# Altium project KB-PCB-R02.PrjPcb (part 1 of 2)
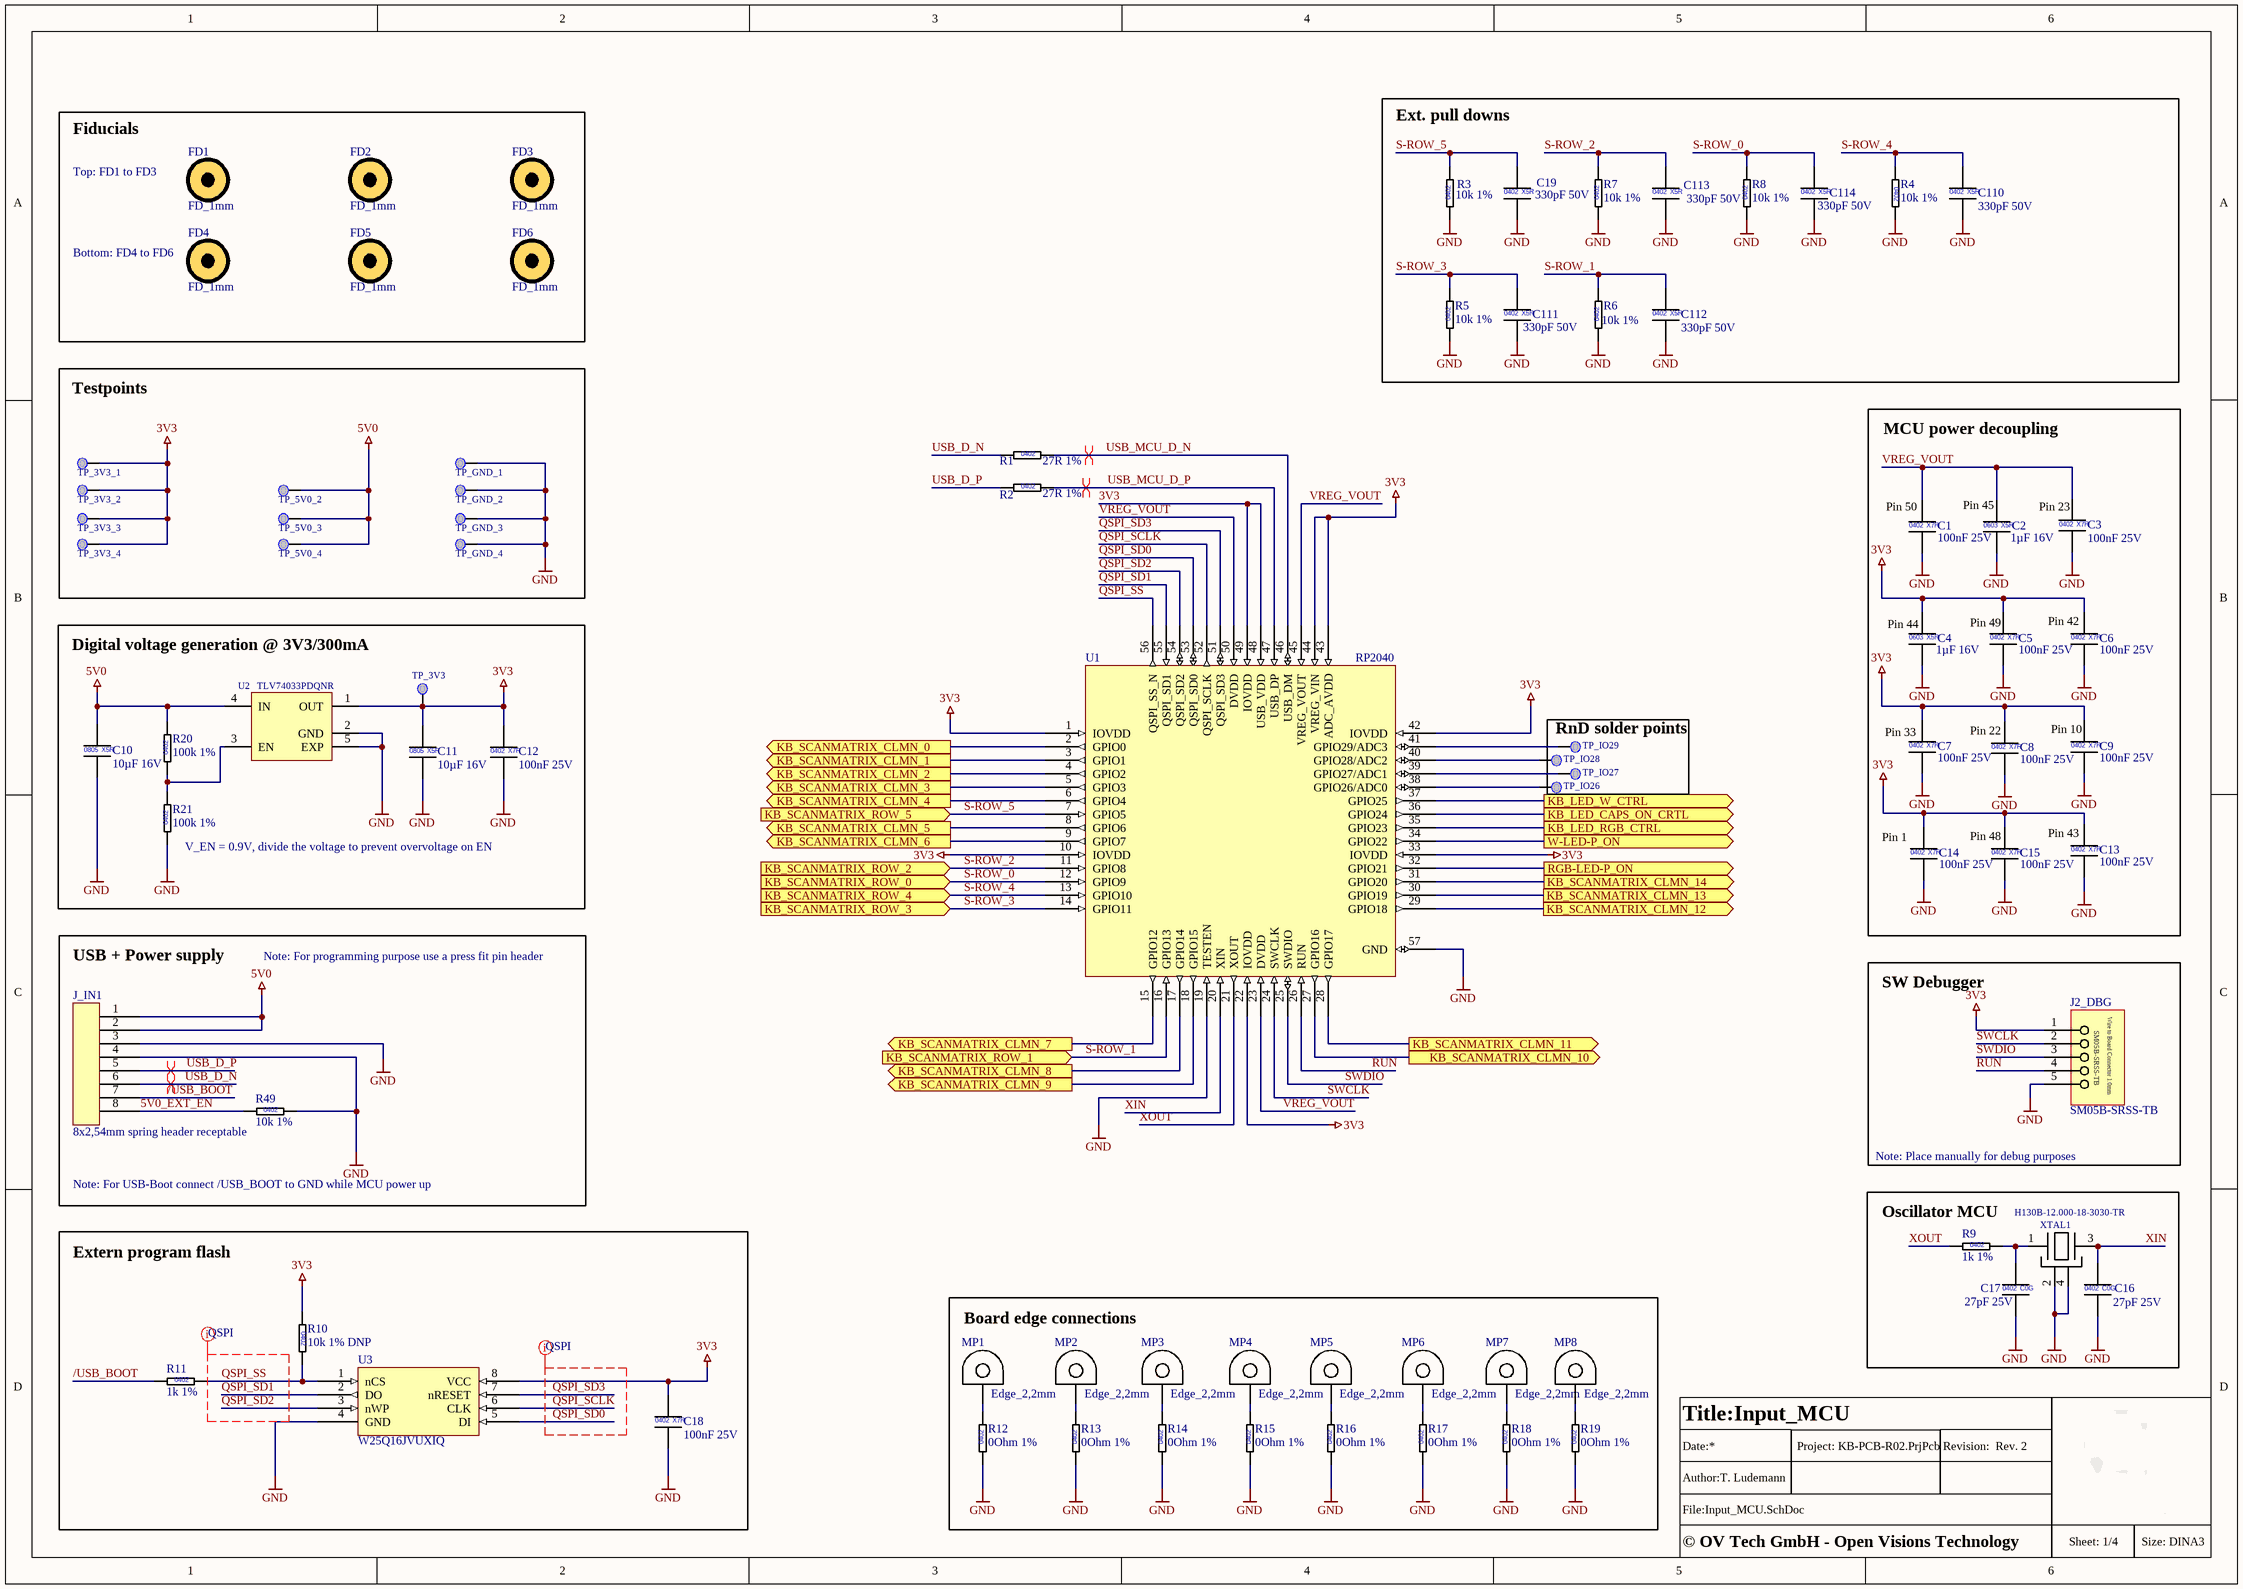
[diagram p0: Input_MCU.SchDoc]
Revision: Rev. 2
4 sheets, 690 parts. Net scope: flat (ports and power ports of the same name join across sheets).
Board file: KB-PCB-R02.PcbDoc
Sheets:
  Input_MCU.SchDoc
  Keymatrix_switches.SchDoc
  backlight_RGB.SchDoc
  backlight_W.SchDoc

## Sheet Input_MCU.SchDoc: Input_MCU
size 420 x 297 mm; Author: T. Ludemann; SheetNumber: 1; SheetTotal: 4; DocSize: DINA3

### Parts
(Parts that share a designator on the sheet are numbered #1, #2 ... from top to bottom, then left to right.)
?#1  (no value)  (graphical)
C1  100nF 25V  [CAPC1005X06L]
C2  1µF 16V  [CAPC1608X10L]
C3  100nF 25V  [CAPC1005X06L]
C4  1µF 16V  [CAPC1608X10L]
C5  100nF 25V  [CAPC1005X06L]
C6  100nF 25V  [CAPC1005X06L]
C7  100nF 25V  [CAPC1005X06L]
C8  100nF 25V  [CAPC1005X06L]
C9  100nF 25V  [CAPC1005X06L]
C10  10µF 16V  [CAPC2012X14L]
C11  10µF 16V  [CAPC2012X14L]
C12  100nF 25V  [CAPC1005X06L]
C13  100nF 25V  [CAPC1005X06L]
C14  100nF 25V  [CAPC1005X06L]
C15  100nF 25V  [CAPC1005X06L]
C16  27pF 25V  [CAPC1005X06L]
C17  27pF 25V  [CAPC1005X06L]
C18  100nF 25V  [CAPC1005X06L]
C19  330pF 50V  [CAPC1005X06L]
C110  330pF 50V  [CAPC1005X06L]
C111  330pF 50V  [CAPC1005X06L]
C112  330pF 50V  [CAPC1005X06L]
C113  330pF 50V  [CAPC1005X06L]
C114  330pF 50V  [CAPC1005X06L]
FD1  FD_1mm  [FD_1mm_Copper_3mm_Expansion]  (no BOM)
FD2  FD_1mm  [FD_1mm_Copper_3mm_Expansion]  (no BOM)
FD3  FD_1mm  [FD_1mm_Copper_3mm_Expansion]  (no BOM)
FD4  FD_1mm  [FD_1mm_Copper_3mm_Expansion]  (no BOM)
FD5  FD_1mm  [FD_1mm_Copper_3mm_Expansion]  (no BOM)
FD6  FD_1mm  [FD_1mm_Copper_3mm_Expansion]  (no BOM)
J2_DBG  SM05B-SRSS-TB  [Wire-to-Board SM05B-SRSS-TB]
J_IN1  8x2,54mm spring header receptable  [BOARD-BOARD CON SPRING-LOADED HEADER 8x2,54mm Receptable]  (no BOM)
MP1  Edge_2,2mm  [MP_Keyboard_EdgeMounts_2.2mm]  (no BOM)
MP2  Edge_2,2mm  [MP_Keyboard_EdgeMounts_2.2mm]  (no BOM)
MP3  Edge_2,2mm  [MP_Keyboard_EdgeMounts_2.2mm]  (no BOM)
MP4  Edge_2,2mm  [MP_Keyboard_EdgeMounts_2.2mm]  (no BOM)
MP5  Edge_2,2mm  [MP_Keyboard_EdgeMounts_2.2mm]  (no BOM)
MP6  Edge_2,2mm  [MP_Keyboard_EdgeMounts_2.2mm]  (no BOM)
MP7  Edge_2,2mm  [MP_Keyboard_EdgeMounts_2.2mm]  (no BOM)
MP8  Edge_2,2mm  [MP_Keyboard_EdgeMounts_2.2mm]  (no BOM)
R1  27R 1%  [RESC1005X04L]
R2  27R 1%  [RESC1005X04L]
R3  10k 1%  [RESC1005X04L]
R4  10k 1%  [RESC1005X04L]
R5  10k 1%  [RESC1005X04L]
R6  10k 1%  [RESC1005X04L]
R7  10k 1%  [RESC1005X04L]
R8  10k 1%  [RESC1005X04L]
R9  1k 1%  [RESC1005X04L]
R10  10k 1% DNP  [RESC1005X04L]
R11  1k 1%  [RESC1005X04L]
R12  0Ohm 1%  [RESC1005X04L]
R13  0Ohm 1%  [RESC1005X04L]
R14  0Ohm 1%  [RESC1005X04L]
R15  0Ohm 1%  [RESC1005X04L]
R16  0Ohm 1%  [RESC1005X04L]
R17  0Ohm 1%  [RESC1005X04L]
R18  0Ohm 1%  [RESC1005X04L]
R19  0Ohm 1%  [RESC1005X04L]
R20  100k 1%  [RESC1005X04L]
R21  100k 1%  [RESC1005X04L]
R49  10k 1%  [RESC1005X04L]
TP_3V3  Testpoint 0.75mm  [TP_0.75mm]  (value not drawn)  (no BOM)
TP_3V3_1  Testpoint 0.75mm  [TP_0.75mm]  (value not drawn)  (no BOM)
TP_3V3_2  Testpoint 0.75mm  [TP_0.75mm]  (value not drawn)  (no BOM)
TP_3V3_3  Testpoint 0.75mm  [TP_0.75mm]  (value not drawn)  (no BOM)
TP_3V3_4  Testpoint 0.75mm  [TP_0.75mm]  (value not drawn)  (no BOM)
TP_5V0_2  Testpoint 0.75mm  [TP_0.75mm]  (value not drawn)  (no BOM)
TP_5V0_3  Testpoint 0.75mm  [TP_0.75mm]  (value not drawn)  (no BOM)
TP_5V0_4  Testpoint 0.75mm  [TP_0.75mm]  (value not drawn)  (no BOM)
TP_GND_1  Testpoint 0.75mm  [TP_0.75mm]  (value not drawn)  (no BOM)
TP_GND_2  Testpoint 0.75mm  [TP_0.75mm]  (value not drawn)  (no BOM)
TP_GND_3  Testpoint 0.75mm  [TP_0.75mm]  (value not drawn)  (no BOM)
TP_GND_4  Testpoint 0.75mm  [TP_0.75mm]  (value not drawn)  (no BOM)
TP_IO26  Testpoint 0.75mm  [TP_0.75mm]  (value not drawn)  (no BOM)
TP_IO27  Testpoint 0.75mm  [TP_0.75mm]  (value not drawn)  (no BOM)
TP_IO28  Testpoint 0.75mm  [TP_0.75mm]  (value not drawn)  (no BOM)
TP_IO29  Testpoint 0.75mm  [TP_0.75mm]  (value not drawn)  (no BOM)
U1  RP2040  [QFN40P700X700X90_HS-57M]
U2  TLV74033PDQNR  [X2SON-DFN]
U3  W25Q16JVUXIQ  [SON50P300X60_HS-9N]
XTAL1  H130B-12.000-18-3030-TR  [XTAL_H130B-12.000-18-3030-TR]

### Blocks framed on the sheet
Ext. pull downs: C19 C110-C114 R3-R8
Fiducials: FD1-FD6
Testpoints: TP_3V3_1-TP_3V3_4 TP_5V0_2-TP_5V0_4 TP_GND_1-TP_GND_4
MCU power decoupling: C1-C9 C13-C15
Digital voltage generation @ 3V3/300mA: C10-C12 R20 R21 TP_3V3 U2
RnD solder points: TP_IO26-TP_IO29
USB + Power supply: J_IN1 R49
SW Debugger: J2_DBG
Extern program flash: C18 R10 R11 U3
Oscillator MCU: C16 C17 R9 XTAL1
Board edge connections: MP1-MP8 R12-R19

### Ports
KB_LED_CAPS_ON_CRTL (out), KB_LED_RGB_CTRL (out), KB_LED_W_CTRL (out), KB_SCANMATRIX_CLMN_0 (out), KB_SCANMATRIX_CLMN_1 (out), KB_SCANMATRIX_CLMN_2 (out), KB_SCANMATRIX_CLMN_3 (out), KB_SCANMATRIX_CLMN_4 (out), KB_SCANMATRIX_CLMN_5 (out), KB_SCANMATRIX_CLMN_6 (out), KB_SCANMATRIX_CLMN_7 (out), KB_SCANMATRIX_CLMN_8 (out), KB_SCANMATRIX_CLMN_9 (out), KB_SCANMATRIX_CLMN_10 (out), KB_SCANMATRIX_CLMN_11 (out), KB_SCANMATRIX_CLMN_12 (out), KB_SCANMATRIX_CLMN_13 (out), KB_SCANMATRIX_CLMN_14 (out), KB_SCANMATRIX_ROW_0 (in), KB_SCANMATRIX_ROW_1 (in), KB_SCANMATRIX_ROW_2 (in), KB_SCANMATRIX_ROW_3 (in), KB_SCANMATRIX_ROW_4 (in), KB_SCANMATRIX_ROW_5 (in), RGB-LED-P_ON (out), W-LED-P_ON (out)

### Nets
3V3: C4.1 C5.1 C6.1 C7.1 C8.1 C9.1 C11.1 C12.1 C13.1 C14.1 C15.1 C18.1 J2_DBG.1 R10.1 TP_3V3.TP TP_3V3_1.TP TP_3V3_2.TP TP_3V3_3.TP TP_3V3_4.TP U1.1(IOVDD) U1.10(IOVDD) U1.22(IOVDD) U1.33(IOVDD) U1.42(IOVDD) U1.43(ADC_AVDD) U1.44(VREG_VIN) U1.48(USB_VDD) U1.49(IOVDD) U2.1(OUT) U3.8(VCC)
5V0: C10.1 J_IN1.1 J_IN1.2 R20.2 TP_5V0_2.TP TP_5V0_3.TP TP_5V0_4.TP U2.4(IN)
GND: C1.2 C2.2 C3.2 C4.2 C5.2 C6.2 C7.2 C8.2 C9.2 C10.2 C11.2 C12.2 C13.2 C14.2 C15.2 C16.2 C17.2 C18.2 C19.2 C110.2 C111.2 C112.2 C113.2 C114.2 J2_DBG.5 J_IN1.3 J_IN1.4 R3.1 R4.2 R5.1 R6.1 R7.1 R8.1 R12.1 R13.1 R14.1 R15.1 R16.1 R17.1 R18.1 R19.1 R21.1 R49.2 TP_GND_1.TP TP_GND_2.TP TP_GND_3.TP TP_GND_4.TP U1.19(TESTEN) U1.57(GND) U2.2(GND) U2.5(EXP) U3.4(GND) XTAL1.2 XTAL1.4
5V0_EXT_EN: J_IN1.8 R49.1
/USB_BOOT: J_IN1.7 R11.1
QSPI_SCLK: U1.52(QSPI_SCLK) U3.6(CLK)
QSPI_SD0: U1.53(QSPI_SD0) U3.5(DI)
QSPI_SD1: U1.55(QSPI_SD1) U3.2(DO)
QSPI_SD2: U1.54(QSPI_SD2) U3.3(nWP)
QSPI_SD3: U1.51(QSPI_SD3) U3.7(nRESET)
QSPI_SS: R10.2 R11.2 U1.56(QSPI_SS_N) U3.1(nCS)
RUN: J2_DBG.4 U1.26(RUN)
S-ROW_0: C114.1 R8.2 U1.12(GPIO9) ; port KB_SCANMATRIX_ROW_0
S-ROW_1: C112.1 R6.2 U1.16(GPIO13) ; port KB_SCANMATRIX_ROW_1
S-ROW_2: C113.1 R7.2 U1.11(GPIO8) ; port KB_SCANMATRIX_ROW_2
S-ROW_3: C111.1 R5.2 U1.14(GPIO11) ; port KB_SCANMATRIX_ROW_3
S-ROW_4: C110.1 R4.1 U1.13(GPIO10) ; port KB_SCANMATRIX_ROW_4
S-ROW_5: C19.1 R3.2 U1.7(GPIO5) ; port KB_SCANMATRIX_ROW_5
SWCLK: J2_DBG.2 U1.24(SWCLK)
SWDIO: J2_DBG.3 U1.25(SWDIO)
USB_D_N: J_IN1.6 R1.1
USB_D_P: J_IN1.5 R2.1
USB_MCU_D_N: R1.2 U1.46(USB_DM)
USB_MCU_D_P: R2.2 U1.47(USB_DP)
VREG_VOUT: C1.1 C2.1 C3.1 U1.23(DVDD) U1.45(VREG_VOUT) U1.50(DVDD)
XIN: C16.1 U1.20(XIN) XTAL1.3
XOUT: R9.1 U1.21(XOUT)
NetC17_1: C17.1 R9.2 XTAL1.1
NetMP1_1: MP1.1 R12.2
NetMP2_1: MP2.1 R13.2
NetMP3_1: MP3.1 R14.2
NetMP4_1: MP4.1 R15.2
NetMP5_1: MP5.1 R16.2
NetMP6_1: MP6.1 R17.2
NetMP7_1: MP7.1 R18.2
NetMP8_1: MP8.1 R19.2
NetR20_1: R20.1 R21.2 U2.3(EN)
NetR50_1: U1.37(GPIO25) ; port KB_LED_W_CTRL
NetR55_2: U1.34(GPIO22) ; port W-LED-P_ON
NetR57_1: U1.36(GPIO24) ; port KB_LED_CAPS_ON_CRTL
NetR60_2: U1.35(GPIO23) ; port KB_LED_RGB_CTRL
NetR65_1: U1.32(GPIO21) ; port RGB-LED-P_ON
NetR147_2: U1.2(GPIO0) ; port KB_SCANMATRIX_CLMN_0
NetR148_2: U1.3(GPIO1) ; port KB_SCANMATRIX_CLMN_1
NetR149_2: U1.4(GPIO2) ; port KB_SCANMATRIX_CLMN_2
NetR150_2: U1.5(GPIO3) ; port KB_SCANMATRIX_CLMN_3
NetR151_2: U1.6(GPIO4) ; port KB_SCANMATRIX_CLMN_4
NetR152_2: U1.8(GPIO6) ; port KB_SCANMATRIX_CLMN_5
NetR153_2: U1.9(GPIO7) ; port KB_SCANMATRIX_CLMN_6
NetR154_2: U1.15(GPIO12) ; port KB_SCANMATRIX_CLMN_7
NetR155_2: U1.17(GPIO14) ; port KB_SCANMATRIX_CLMN_8
NetR156_2: U1.18(GPIO15) ; port KB_SCANMATRIX_CLMN_9
NetR157_2: U1.27(GPIO16) ; port KB_SCANMATRIX_CLMN_10
NetR158_2: U1.28(GPIO17) ; port KB_SCANMATRIX_CLMN_11
NetR159_2: U1.29(GPIO18) ; port KB_SCANMATRIX_CLMN_12
NetR160_2: U1.30(GPIO19) ; port KB_SCANMATRIX_CLMN_13
NetR161_2: U1.31(GPIO20) ; port KB_SCANMATRIX_CLMN_14
NetTP_IO26_TP: TP_IO26.TP U1.38(GPIO26/ADC0)
NetTP_IO27_TP: TP_IO27.TP U1.39(GPIO27/ADC1)
NetTP_IO28_TP: TP_IO28.TP U1.40(GPIO28/ADC2)
NetTP_IO29_TP: TP_IO29.TP U1.41(GPIO29/ADC3)

### Layout directives
differential pair: USB_D_N, USB_D_P, USB_MCU_D_N, USB_MCU_D_P
net class QSPI: QSPI_SCLK, QSPI_SD0, QSPI_SD1, QSPI_SD2, QSPI_SD3, QSPI_SS

### Notes on the sheet
- (near FD1) Top: FD1 to FD3
- (near FD4) Bottom: FD4 to FD6
- (near C1) Pin 50
- (near C2) Pin 45
- (near C3) Pin 23
- (near C4) Pin 44
- (near C5) Pin 49
- (near C6) Pin 42
- (near C8) Pin 22
- (near C9) Pin 10
- (near C7) Pin 33
- (near R21) V_EN = 0.9V, divide the voltage to prevent overvoltage on EN
- (near C14) Pin 1
- (near C15) Pin 48
- (near C13) Pin 43
- Note: For programming purpose use a press fit pin header
- Note: For USB-Boot connect /USB_BOOT to GND while MCU power up
- Note: Place manually for debug purposes
- © OV Tech GmbH - Open Visions Technology
- (in symbol CAP_0402_27pF_50V) 0402; C0G
- (in symbol CAP_0402_100nF_25V) 0402; X7R
- (in symbol CAP_0402_330p_50V) 0402; X5R
- (in symbol CAP_0603_1µ_16V) 0603; X5R
- (in symbol CAP_0805_10µ_16V) 0805; X5R
- (in symbol RES_0402_0R_1%) 0402
- (in symbol RES_0402_1k_1%) 0402
- (in symbol RES_0402_10k_1%) 0402
- (in symbol RES_0402_27R_1%) 0402
- (in symbol RES_0402_100k_1%) 0402
- (in symbol Wire to Board Connector_5pol_SM05B-SRSS-TB) Wire to Board Connector 1.0mm

### Library data of the parts
?#1 = Titleblock_01
C1 C3 C5-C9 C12-C15 C18 = CAP_0402_100nF_25V: Multilayer Ceramic Capacitors MLCC - SMD/SMT 0402 25VDC; Manufacturer 1: KYOCERA AVX; Manufacturer 1 Prt. Nr.: KGM05AR71C104KH; Manufacturer 2 Prt. Nr.: EMK105B7104KV-F; Manufacturer 2: Taiyo Yuden
C2 C4 = CAP_0603_1µ_16V: Multilayer Ceramic Capacitors MLCC - SMD/SMT 0603 16VDC; Manufacturer 1: Samsung Electro-Mechanics; Manufacturer 1 Prt. Nr.: CL05A105KO5NNNC; Manufacturer 2 Prt. Nr.: EMK105BJ105KV-F; Manufacturer 2: Taiyo Yuden
C10 C11 = CAP_0805_10µ_16V: Multilayer Ceramic Capacitors MLCC - SMD/SMT 0603 25VDC; Manufacturer 1: Samsung Electro-Mechanics; Manufacturer 1 Prt. Nr.: CL21A106KOQNNNG; Manufacturer 2 Prt. Nr.: C0805C106K8PAC7210; Manufacturer 2: KEMET
C16 C17 = CAP_0402_27pF_50V: Multilayer Ceramic Capacitors MLCC - SMD/SMT 0402 50VDC; Manufacturer 1: Johanson Technology Inc.; Manufacturer 1 Prt. Nr.: QSCF500Q270G1GV001T; Manufacturer 2 Prt. Nr.: GJM1555C1H270GB01D; Manufacturer 2: Murata Electronics
C19 C110-C114 = CAP_0402_330p_50V: Multilayer Ceramic Capacitors MLCC - SMD/SMT 0402 50VDC; Manufacturer 1: Murata Electronics; Manufacturer 1 Prt. Nr.: GCM1555C1H331FA16J; Manufacturer 2 Prt. Nr.: C0402C331J5GACAUTO; Manufacturer 2: KEMET
FD1-FD6 = MP_Fiducial_1mm: Fiducial with 1 mm radius and 3mm soldermask expansion
J2_DBG = Wire to Board Connector_5pol_SM05B-SRSS-TB: Wire to Board Connector 5pol 1.0mm Pitch; Manufacturer 1: JST; Manufacturer 1 Prt. Nr.: SM05B-SRSS-TB
J_IN1 = Board to Board Connector_816-22-008-10-004101_receptable: 8x2,54 spring header receptable; Manufacturer 1: N/A; Manufacturer Part Number1: N/A
MP1-MP8 = MP_Keyboard_EdgeMount_2.2mm: Edgemount for keyboard
R1 R2 = RES_0402_27R_1%: Thick Film Resistors - SMD 27R 1%; Manufacturer 1: YAGEO; Manufacturer 1 Prt. Nr.: RC0402FR-0727RL; Manufacturer 2 Prt. Nr.: CRGCQ0402F27R; Manufacturer 2: TE Connectivity Passive Product
R3-R8 R10 R49 = RES_0402_10k_1%: Thick Film Resistors - SMD 10k 1%; Manufacturer 1: Vishay / Dale; Manufacturer 1 Prt. Nr.: CRCW040210K0FKEDC; Manufacturer 2 Prt. Nr.: RT0402FRE0710KL; Manufacturer 2: YAGEO
R9 R11 = RES_0402_1k_1%: Thick Film Resistors - SMD 1k 1%; Manufacturer 1: Vishay / Dale; Manufacturer 1 Prt. Nr.: CRCW04021K00FKEDC; Manufacturer 2 Prt. Nr.: RT0402FRE131KL; Manufacturer 2: YAGEO
R12-R19 = RES_0402_0R_1%: Thick Film Resistors - SMD 0OHM 1%; Manufacturer 1: Bourns; Manufacturer 1 Prt. Nr.: CR0402AJ/-000GAS; Manufacturer 2 Prt. Nr.: AC0402FR-070RL; Manufacturer 2: YAGEO
R20 R21 = RES_0402_100k_1%: Thick Film Resistors - SMD 100k 1%; Manufacturer 1: Vishay / Dale; Manufacturer 1 Prt. Nr.: CRCW0402100KFKEDC; Manufacturer 2 Prt. Nr.: RC0402FR-07100KL; Manufacturer 2: YAGEO
U1 = uC_32bit_30IO_RP2040: 32Bit Microcontroller 30IO 133MHz RP2040; Manufacturer 1: Raspberry Pi Foundation; Manufacturer 1 Prt. Nr.: RP2040
U2 = LDO 3.3V_TLV74033PDQNR: LDO voltage regulator 300mA X2SON; Manufacturer 1: Texas Instruments; Manufacturer 1 Prt. Nr.: TLV74033PDQNR
U3 = NOR_Flash_W25Q16JVUXIQ: NOR Flash spiFlash, 3V, 16M-bit, 4Kb Uniform Sector, DTR; Manufacturer 1: Winbond; Manufacturer Part Number 1: W25Q16JVUXIQ
XTAL1 = Crystal_RE-5032_12MHz: CRYSTAL 12.0000MHZ 18PF SMD; Manufacturer 1: Raltron Electronics; Manufacturer 1 Prt. Nr.: H130B-12.000-18-3030-TR

## Sheet Keymatrix_switches.SchDoc: Keymatrix switches
size 594 x 420 mm; SheetNumber: 2; SheetTotal: 4; DocSize: DINA2
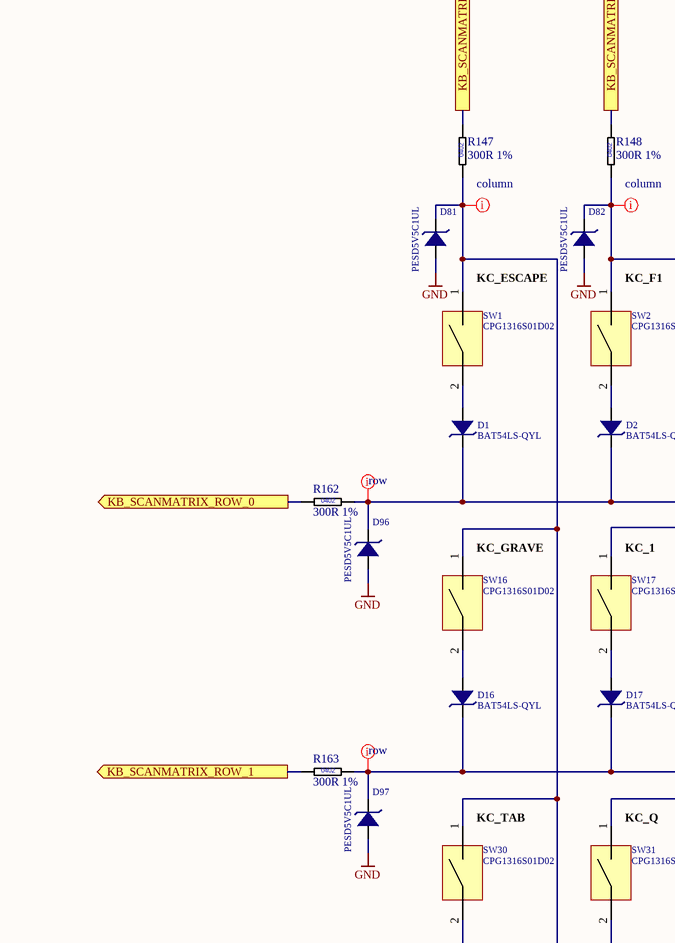
[diagram p1: Keymatrix_switches.SchDoc, top middle]
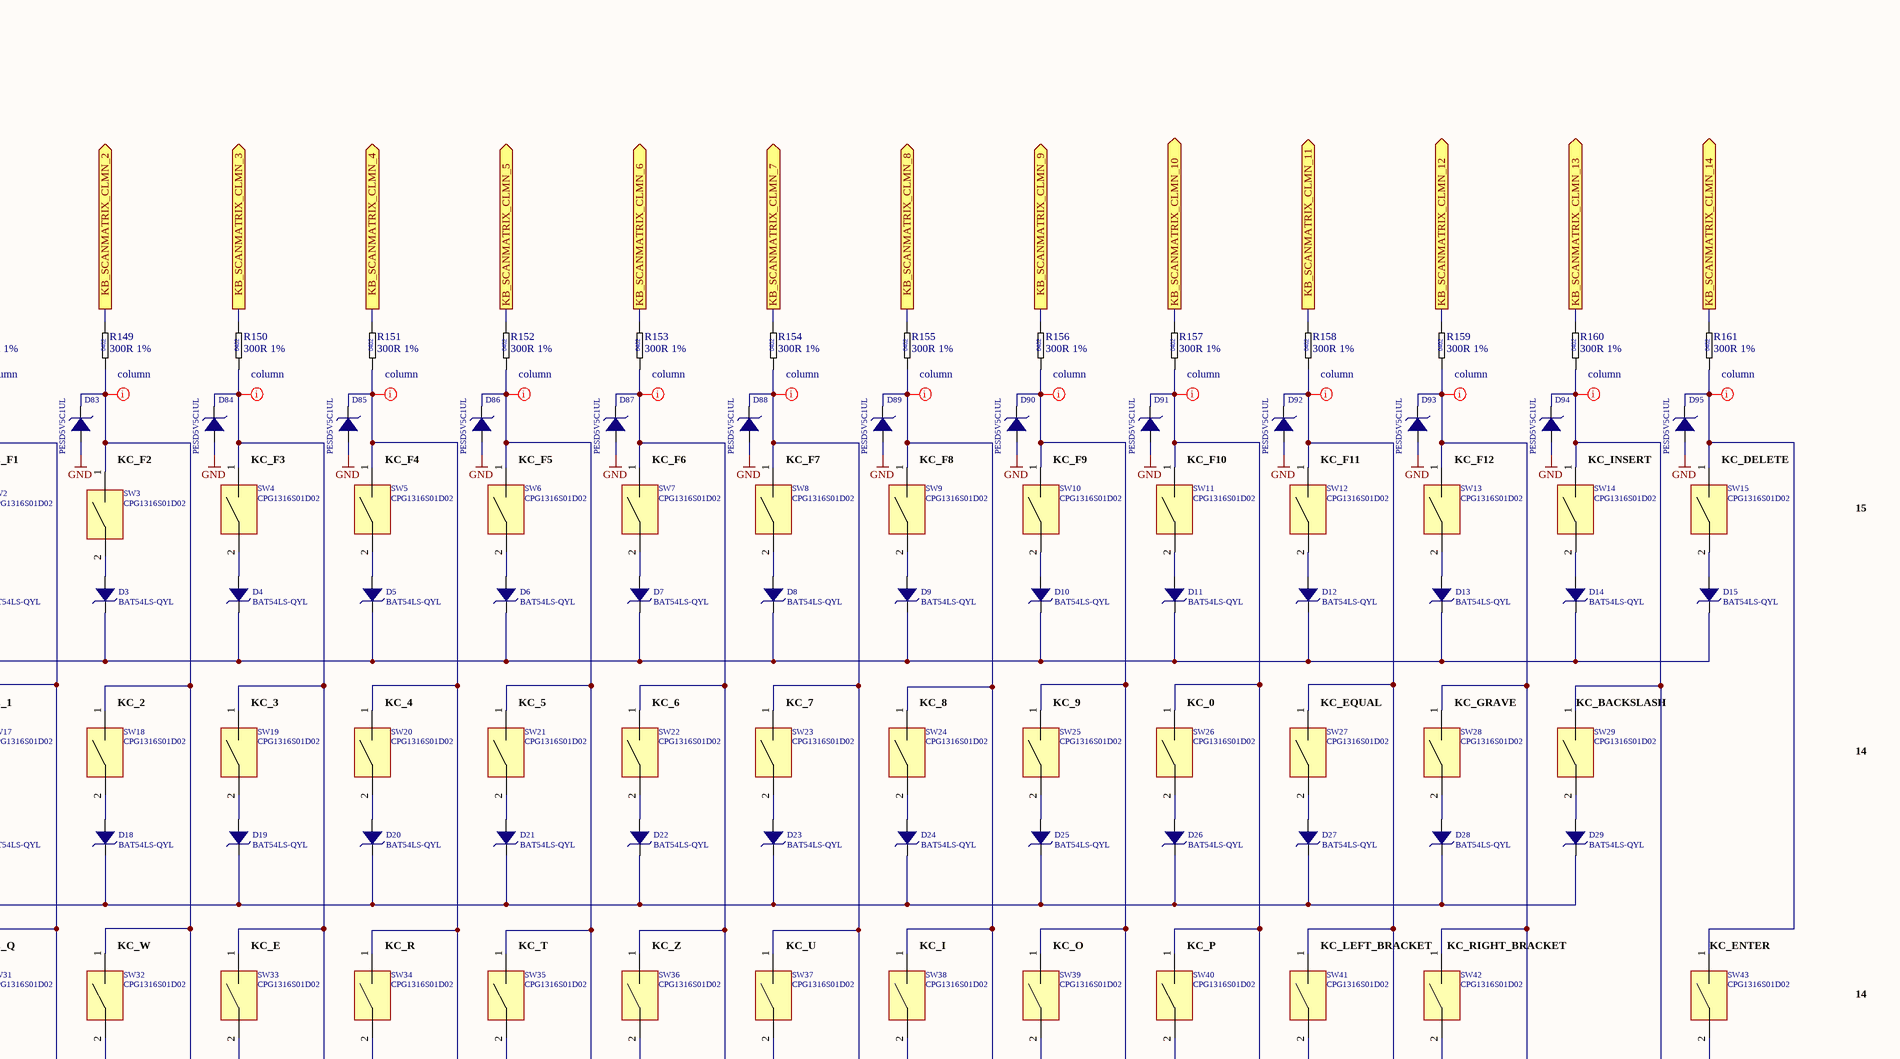
[diagram p2: Keymatrix_switches.SchDoc, top right]
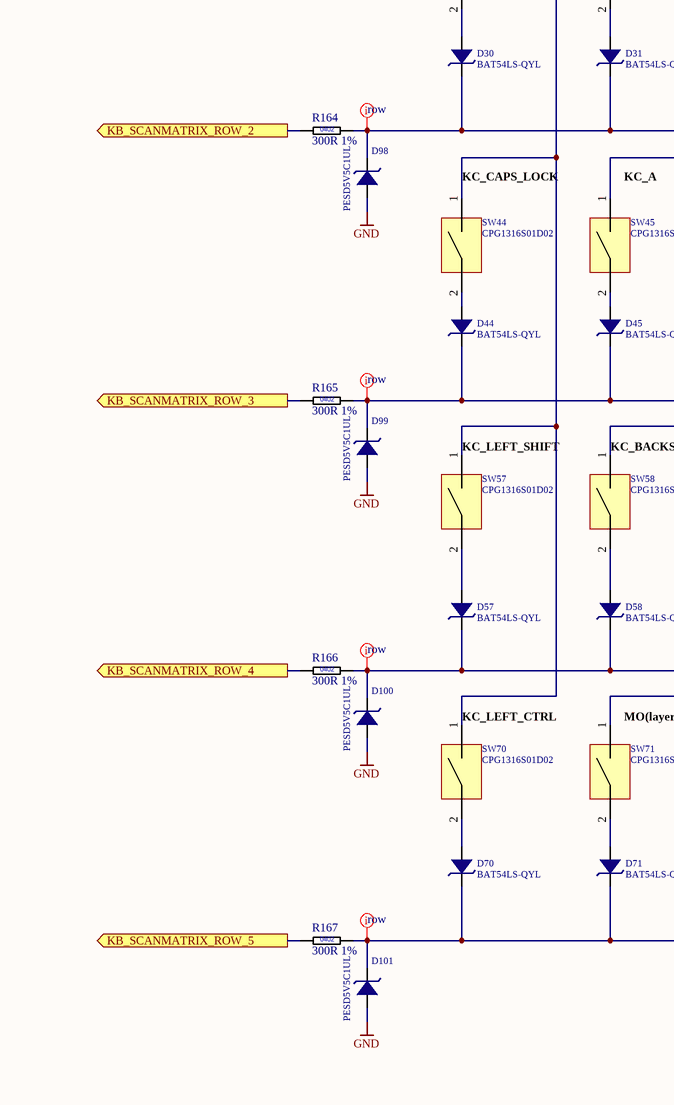
[diagram p3: Keymatrix_switches.SchDoc, bottom middle]
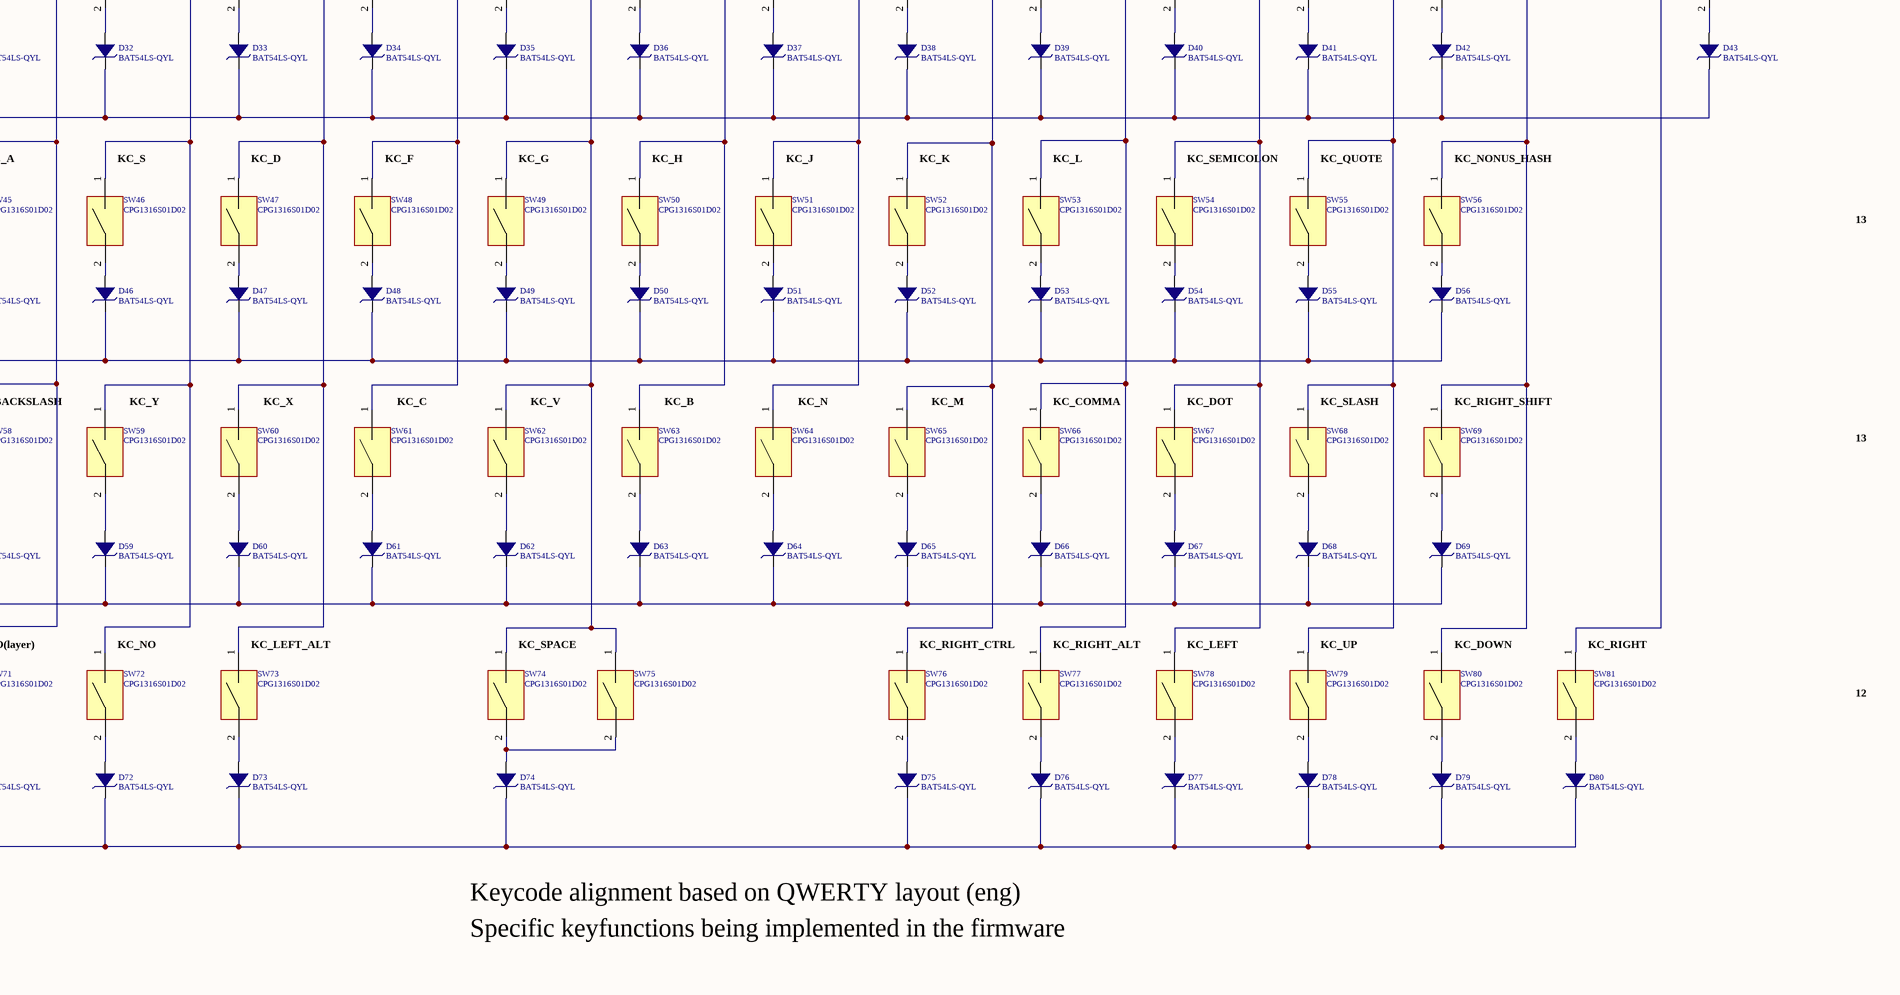
[diagram p4: Keymatrix_switches.SchDoc, bottom right]

### Parts
(Parts that share a designator on the sheet are numbered #1, #2 ... from top to bottom, then left to right.)
?#2  (no value)  (graphical)
D1  BAT54LS-QYL  [DFN1006-2A]
D2  BAT54LS-QYL  [DFN1006-2A]
D3  BAT54LS-QYL  [DFN1006-2A]
D4  BAT54LS-QYL  [DFN1006-2A]
D5  BAT54LS-QYL  [DFN1006-2A]
D6  BAT54LS-QYL  [DFN1006-2A]
D7  BAT54LS-QYL  [DFN1006-2A]
D8  BAT54LS-QYL  [DFN1006-2A]
D9  BAT54LS-QYL  [DFN1006-2A]
D10  BAT54LS-QYL  [DFN1006-2A]
D11  BAT54LS-QYL  [DFN1006-2A]
D12  BAT54LS-QYL  [DFN1006-2A]
D13  BAT54LS-QYL  [DFN1006-2A]
D14  BAT54LS-QYL  [DFN1006-2A]
D15  BAT54LS-QYL  [DFN1006-2A]
D16  BAT54LS-QYL  [DFN1006-2A]
D17  BAT54LS-QYL  [DFN1006-2A]
D18  BAT54LS-QYL  [DFN1006-2A]
D19  BAT54LS-QYL  [DFN1006-2A]
D20  BAT54LS-QYL  [DFN1006-2A]
D21  BAT54LS-QYL  [DFN1006-2A]
D22  BAT54LS-QYL  [DFN1006-2A]
D23  BAT54LS-QYL  [DFN1006-2A]
D24  BAT54LS-QYL  [DFN1006-2A]
D25  BAT54LS-QYL  [DFN1006-2A]
D26  BAT54LS-QYL  [DFN1006-2A]
D27  BAT54LS-QYL  [DFN1006-2A]
D28  BAT54LS-QYL  [DFN1006-2A]
D29  BAT54LS-QYL  [DFN1006-2A]
D30  BAT54LS-QYL  [DFN1006-2A]
D31  BAT54LS-QYL  [DFN1006-2A]
D32  BAT54LS-QYL  [DFN1006-2A]
D33  BAT54LS-QYL  [DFN1006-2A]
D34  BAT54LS-QYL  [DFN1006-2A]
D35  BAT54LS-QYL  [DFN1006-2A]
D36  BAT54LS-QYL  [DFN1006-2A]
D37  BAT54LS-QYL  [DFN1006-2A]
D38  BAT54LS-QYL  [DFN1006-2A]
D39  BAT54LS-QYL  [DFN1006-2A]
D40  BAT54LS-QYL  [DFN1006-2A]
D41  BAT54LS-QYL  [DFN1006-2A]
D42  BAT54LS-QYL  [DFN1006-2A]
D43  BAT54LS-QYL  [DFN1006-2A]
D44  BAT54LS-QYL  [DFN1006-2A]
D45  BAT54LS-QYL  [DFN1006-2A]
D46  BAT54LS-QYL  [DFN1006-2A]
D47  BAT54LS-QYL  [DFN1006-2A]
D48  BAT54LS-QYL  [DFN1006-2A]
D49  BAT54LS-QYL  [DFN1006-2A]
D50  BAT54LS-QYL  [DFN1006-2A]
D51  BAT54LS-QYL  [DFN1006-2A]
D52  BAT54LS-QYL  [DFN1006-2A]
D53  BAT54LS-QYL  [DFN1006-2A]
D54  BAT54LS-QYL  [DFN1006-2A]
D55  BAT54LS-QYL  [DFN1006-2A]
D56  BAT54LS-QYL  [DFN1006-2A]
D57  BAT54LS-QYL  [DFN1006-2A]
D58  BAT54LS-QYL  [DFN1006-2A]
D59  BAT54LS-QYL  [DFN1006-2A]
D60  BAT54LS-QYL  [DFN1006-2A]
D61  BAT54LS-QYL  [DFN1006-2A]
D62  BAT54LS-QYL  [DFN1006-2A]
D63  BAT54LS-QYL  [DFN1006-2A]
D64  BAT54LS-QYL  [DFN1006-2A]
D65  BAT54LS-QYL  [DFN1006-2A]
D66  BAT54LS-QYL  [DFN1006-2A]
D67  BAT54LS-QYL  [DFN1006-2A]
D68  BAT54LS-QYL  [DFN1006-2A]
D69  BAT54LS-QYL  [DFN1006-2A]
D70  BAT54LS-QYL  [DFN1006-2A]
D71  BAT54LS-QYL  [DFN1006-2A]
D72  BAT54LS-QYL  [DFN1006-2A]
D73  BAT54LS-QYL  [DFN1006-2A]
D74  BAT54LS-QYL  [DFN1006-2A]
D75  BAT54LS-QYL  [DFN1006-2A]
D76  BAT54LS-QYL  [DFN1006-2A]
D77  BAT54LS-QYL  [DFN1006-2A]
D78  BAT54LS-QYL  [DFN1006-2A]
D79  BAT54LS-QYL  [DFN1006-2A]
D80  BAT54LS-QYL  [DFN1006-2A]
D81  PESD5V5C1UL  [DFN65P100X50-2N]
D82  PESD5V5C1UL  [DFN65P100X50-2N]
D83  PESD5V5C1UL  [DFN65P100X50-2N]
D84  PESD5V5C1UL  [DFN65P100X50-2N]
D85  PESD5V5C1UL  [DFN65P100X50-2N]
D86  PESD5V5C1UL  [DFN65P100X50-2N]
D87  PESD5V5C1UL  [DFN65P100X50-2N]
D88  PESD5V5C1UL  [DFN65P100X50-2N]
D89  PESD5V5C1UL  [DFN65P100X50-2N]
D90  PESD5V5C1UL  [DFN65P100X50-2N]
D91  PESD5V5C1UL  [DFN65P100X50-2N]
D92  PESD5V5C1UL  [DFN65P100X50-2N]
D93  PESD5V5C1UL  [DFN65P100X50-2N]
D94  PESD5V5C1UL  [DFN65P100X50-2N]
D95  PESD5V5C1UL  [DFN65P100X50-2N]
D96  PESD5V5C1UL  [DFN65P100X50-2N]
D97  PESD5V5C1UL  [DFN65P100X50-2N]
D98  PESD5V5C1UL  [DFN65P100X50-2N]
D99  PESD5V5C1UL  [DFN65P100X50-2N]
D100  PESD5V5C1UL  [DFN65P100X50-2N]
D101  PESD5V5C1UL  [DFN65P100X50-2N]
R147  300R 1%  [RESC1005X04L]
R148  300R 1%  [RESC1005X04L]
R149  300R 1%  [RESC1005X04L]
R150  300R 1%  [RESC1005X04L]
R151  300R 1%  [RESC1005X04L]
R152  300R 1%  [RESC1005X04L]
R153  300R 1%  [RESC1005X04L]
R154  300R 1%  [RESC1005X04L]
R155  300R 1%  [RESC1005X04L]
R156  300R 1%  [RESC1005X04L]
R157  300R 1%  [RESC1005X04L]
R158  300R 1%  [RESC1005X04L]
R159  300R 1%  [RESC1005X04L]
R160  300R 1%  [RESC1005X04L]
R161  300R 1%  [RESC1005X04L]
R162  300R 1%  [RESC1005X04L]
R163  300R 1%  [RESC1005X04L]
R164  300R 1%  [RESC1005X04L]
R165  300R 1%  [RESC1005X04L]
R166  300R 1%  [RESC1005X04L]
R167  300R 1%  [RESC1005X04L]
SW1  CPG1316S01D02  [SW_KEYBOARD_KAIHL-PG1316S]
SW2  CPG1316S01D02  [SW_KEYBOARD_KAIHL-PG1316S]
SW3  CPG1316S01D02  [SW_KEYBOARD_KAIHL-PG1316S]
SW4  CPG1316S01D02  [SW_KEYBOARD_KAIHL-PG1316S]
SW5  CPG1316S01D02  [SW_KEYBOARD_KAIHL-PG1316S]
SW6  CPG1316S01D02  [SW_KEYBOARD_KAIHL-PG1316S]
SW7  CPG1316S01D02  [SW_KEYBOARD_KAIHL-PG1316S]
SW8  CPG1316S01D02  [SW_KEYBOARD_KAIHL-PG1316S]
SW9  CPG1316S01D02  [SW_KEYBOARD_KAIHL-PG1316S]
SW10  CPG1316S01D02  [SW_KEYBOARD_KAIHL-PG1316S]
SW11  CPG1316S01D02  [SW_KEYBOARD_KAIHL-PG1316S]
SW12  CPG1316S01D02  [SW_KEYBOARD_KAIHL-PG1316S]
SW13  CPG1316S01D02  [SW_KEYBOARD_KAIHL-PG1316S]
SW14  CPG1316S01D02  [SW_KEYBOARD_KAIHL-PG1316S]
SW15  CPG1316S01D02  [SW_KEYBOARD_KAIHL-PG1316S]
SW16  CPG1316S01D02  [SW_KEYBOARD_KAIHL-PG1316S]
SW17  CPG1316S01D02  [SW_KEYBOARD_KAIHL-PG1316S]
SW18  CPG1316S01D02  [SW_KEYBOARD_KAIHL-PG1316S]
SW19  CPG1316S01D02  [SW_KEYBOARD_KAIHL-PG1316S]
SW20  CPG1316S01D02  [SW_KEYBOARD_KAIHL-PG1316S]
SW21  CPG1316S01D02  [SW_KEYBOARD_KAIHL-PG1316S]
SW22  CPG1316S01D02  [SW_KEYBOARD_KAIHL-PG1316S]
SW23  CPG1316S01D02  [SW_KEYBOARD_KAIHL-PG1316S]
SW24  CPG1316S01D02  [SW_KEYBOARD_KAIHL-PG1316S]
SW25  CPG1316S01D02  [SW_KEYBOARD_KAIHL-PG1316S]
SW26  CPG1316S01D02  [SW_KEYBOARD_KAIHL-PG1316S]
SW27  CPG1316S01D02  [SW_KEYBOARD_KAIHL-PG1316S]
SW28  CPG1316S01D02  [SW_KEYBOARD_KAIHL-PG1316S]
SW29  CPG1316S01D02  [SW_KEYBOARD_KAIHL-PG1316S]
SW30  CPG1316S01D02  [SW_KEYBOARD_KAIHL-PG1316S]
SW31  CPG1316S01D02  [SW_KEYBOARD_KAIHL-PG1316S]
SW32  CPG1316S01D02  [SW_KEYBOARD_KAIHL-PG1316S]
SW33  CPG1316S01D02  [SW_KEYBOARD_KAIHL-PG1316S]
SW34  CPG1316S01D02  [SW_KEYBOARD_KAIHL-PG1316S]
SW35  CPG1316S01D02  [SW_KEYBOARD_KAIHL-PG1316S]
SW36  CPG1316S01D02  [SW_KEYBOARD_KAIHL-PG1316S]
SW37  CPG1316S01D02  [SW_KEYBOARD_KAIHL-PG1316S]
SW38  CPG1316S01D02  [SW_KEYBOARD_KAIHL-PG1316S]
SW39  CPG1316S01D02  [SW_KEYBOARD_KAIHL-PG1316S]
SW40  CPG1316S01D02  [SW_KEYBOARD_KAIHL-PG1316S]
SW41  CPG1316S01D02  [SW_KEYBOARD_KAIHL-PG1316S]
SW42  CPG1316S01D02  [SW_KEYBOARD_KAIHL-PG1316S]
SW43  CPG1316S01D02  [SW_KEYBOARD_KAIHL-PG1316S]
SW44  CPG1316S01D02  [SW_KEYBOARD_KAIHL-PG1316S]
SW45  CPG1316S01D02  [SW_KEYBOARD_KAIHL-PG1316S]
SW46  CPG1316S01D02  [SW_KEYBOARD_KAIHL-PG1316S]
SW47  CPG1316S01D02  [SW_KEYBOARD_KAIHL-PG1316S]
SW48  CPG1316S01D02  [SW_KEYBOARD_KAIHL-PG1316S]
SW49  CPG1316S01D02  [SW_KEYBOARD_KAIHL-PG1316S]
SW50  CPG1316S01D02  [SW_KEYBOARD_KAIHL-PG1316S]
SW51  CPG1316S01D02  [SW_KEYBOARD_KAIHL-PG1316S]
SW52  CPG1316S01D02  [SW_KEYBOARD_KAIHL-PG1316S]
SW53  CPG1316S01D02  [SW_KEYBOARD_KAIHL-PG1316S]
SW54  CPG1316S01D02  [SW_KEYBOARD_KAIHL-PG1316S]
SW55  CPG1316S01D02  [SW_KEYBOARD_KAIHL-PG1316S]
SW56  CPG1316S01D02  [SW_KEYBOARD_KAIHL-PG1316S]
SW57  CPG1316S01D02  [SW_KEYBOARD_KAIHL-PG1316S]
SW58  CPG1316S01D02  [SW_KEYBOARD_KAIHL-PG1316S]
SW59  CPG1316S01D02  [SW_KEYBOARD_KAIHL-PG1316S]
SW60  CPG1316S01D02  [SW_KEYBOARD_KAIHL-PG1316S]
SW61  CPG1316S01D02  [SW_KEYBOARD_KAIHL-PG1316S]
SW62  CPG1316S01D02  [SW_KEYBOARD_KAIHL-PG1316S]
SW63  CPG1316S01D02  [SW_KEYBOARD_KAIHL-PG1316S]
SW64  CPG1316S01D02  [SW_KEYBOARD_KAIHL-PG1316S]
SW65  CPG1316S01D02  [SW_KEYBOARD_KAIHL-PG1316S]
SW66  CPG1316S01D02  [SW_KEYBOARD_KAIHL-PG1316S]
SW67  CPG1316S01D02  [SW_KEYBOARD_KAIHL-PG1316S]
SW68  CPG1316S01D02  [SW_KEYBOARD_KAIHL-PG1316S]
SW69  CPG1316S01D02  [SW_KEYBOARD_KAIHL-PG1316S]
SW70  CPG1316S01D02  [SW_KEYBOARD_KAIHL-PG1316S]
SW71  CPG1316S01D02  [SW_KEYBOARD_KAIHL-PG1316S]
SW72  CPG1316S01D02  [SW_KEYBOARD_KAIHL-PG1316S]
SW73  CPG1316S01D02  [SW_KEYBOARD_KAIHL-PG1316S]
SW74  CPG1316S01D02  [SW_KEYBOARD_KAIHL-PG1316S]
SW75  CPG1316S01D02  [SW_KEYBOARD_KAIHL-PG1316S]
SW76  CPG1316S01D02  [SW_KEYBOARD_KAIHL-PG1316S]
SW77  CPG1316S01D02  [SW_KEYBOARD_KAIHL-PG1316S]
SW78  CPG1316S01D02  [SW_KEYBOARD_KAIHL-PG1316S]
SW79  CPG1316S01D02  [SW_KEYBOARD_KAIHL-PG1316S]
SW80  CPG1316S01D02  [SW_KEYBOARD_KAIHL-PG1316S]
SW81  CPG1316S01D02  [SW_KEYBOARD_KAIHL-PG1316S]

### Ports
KB_SCANMATRIX_CLMN_0 (out), KB_SCANMATRIX_CLMN_1 (out), KB_SCANMATRIX_CLMN_2 (out), KB_SCANMATRIX_CLMN_3 (out), KB_SCANMATRIX_CLMN_4 (out), KB_SCANMATRIX_CLMN_5 (out), KB_SCANMATRIX_CLMN_6 (out), KB_SCANMATRIX_CLMN_7 (out), KB_SCANMATRIX_CLMN_8 (out), KB_SCANMATRIX_CLMN_9 (out), KB_SCANMATRIX_CLMN_10 (out), KB_SCANMATRIX_CLMN_11 (out), KB_SCANMATRIX_CLMN_12 (out), KB_SCANMATRIX_CLMN_13 (out), KB_SCANMATRIX_CLMN_14 (out), KB_SCANMATRIX_ROW_0 (out), KB_SCANMATRIX_ROW_1 (out), KB_SCANMATRIX_ROW_2 (out), KB_SCANMATRIX_ROW_3 (out), KB_SCANMATRIX_ROW_4 (out), KB_SCANMATRIX_ROW_5 (out)

### Nets
GND: D81.2 D82.2 D83.2 D84.2 D85.2 D86.2 D87.2 D88.2 D89.2 D90.2 D91.2 D92.2 D93.2 D94.2 D95.2 D96.2 D97.2 D98.2 D99.2 D100.2 D101.2
S-ROW_0: R162.1 ; port KB_SCANMATRIX_ROW_0
S-ROW_1: R163.1 ; port KB_SCANMATRIX_ROW_1
S-ROW_2: R164.1 ; port KB_SCANMATRIX_ROW_2
S-ROW_3: R165.1 ; port KB_SCANMATRIX_ROW_3
S-ROW_4: R166.1 ; port KB_SCANMATRIX_ROW_4
S-ROW_5: R167.1 ; port KB_SCANMATRIX_ROW_5
NetD1_1: D1.1 D2.1 D3.1 D4.1 D5.1 D6.1 D7.1 D8.1 D9.1 D10.1 D11.1 D12.1 D13.1 D14.1 D15.1 D96.1 R162.2
NetD1_2: D1.2 SW1.2
NetD2_2: D2.2 SW2.2
NetD3_2: D3.2 SW3.2
NetD4_2: D4.2 SW4.2
NetD5_2: D5.2 SW5.2
NetD6_2: D6.2 SW6.2
NetD7_2: D7.2 SW7.2
NetD8_2: D8.2 SW8.2
NetD9_2: D9.2 SW9.2
NetD10_2: D10.2 SW10.2
NetD11_2: D11.2 SW11.2
NetD12_2: D12.2 SW12.2
NetD13_2: D13.2 SW13.2
NetD14_2: D14.2 SW14.2
NetD15_2: D15.2 SW15.2
NetD16_1: D16.1 D17.1 D18.1 D19.1 D20.1 D21.1 D22.1 D23.1 D24.1 D25.1 D26.1 D27.1 D28.1 D29.1 D97.1 R163.2
NetD16_2: D16.2 SW16.2
NetD17_2: D17.2 SW17.2
NetD18_2: D18.2 SW18.2
NetD19_2: D19.2 SW19.2
NetD20_2: D20.2 SW20.2
NetD21_2: D21.2 SW21.2
NetD22_2: D22.2 SW22.2
NetD23_2: D23.2 SW23.2
NetD24_2: D24.2 SW24.2
NetD25_2: D25.2 SW25.2
NetD26_2: D26.2 SW26.2
NetD27_2: D27.2 SW27.2
NetD28_2: D28.2 SW28.2
NetD29_2: D29.2 SW29.2
NetD30_1: D30.1 D31.1 D32.1 D33.1 D34.1 D35.1 D36.1 D37.1 D38.1 D39.1 D40.1 D41.1 D42.1 D43.1 D98.1 R164.2
NetD30_2: D30.2 SW30.2
NetD31_2: D31.2 SW31.2
NetD32_2: D32.2 SW32.2
NetD33_2: D33.2 SW33.2
NetD34_2: D34.2 SW34.2
NetD35_2: D35.2 SW35.2
NetD36_2: D36.2 SW36.2
NetD37_2: D37.2 SW37.2
NetD38_2: D38.2 SW38.2
NetD39_2: D39.2 SW39.2
NetD40_2: D40.2 SW40.2
NetD41_2: D41.2 SW41.2
NetD42_2: D42.2 SW42.2
NetD43_2: D43.2 SW43.2
NetD44_1: D44.1 D45.1 D46.1 D47.1 D48.1 D49.1 D50.1 D51.1 D52.1 D53.1 D54.1 D55.1 D56.1 D99.1 R165.2
NetD44_2: D44.2 SW44.2
NetD45_2: D45.2 SW45.2
NetD46_2: D46.2 SW46.2
NetD47_2: D47.2 SW47.2
NetD48_2: D48.2 SW48.2
NetD49_2: D49.2 SW49.2
NetD50_2: D50.2 SW50.2
NetD51_2: D51.2 SW51.2
NetD52_2: D52.2 SW52.2
NetD53_2: D53.2 SW53.2
NetD54_2: D54.2 SW54.2
NetD55_2: D55.2 SW55.2
NetD56_2: D56.2 SW56.2
NetD57_1: D57.1 D58.1 D59.1 D60.1 D61.1 D62.1 D63.1 D64.1 D65.1 D66.1 D67.1 D68.1 D69.1 D100.1 R166.2
NetD57_2: D57.2 SW57.2
NetD58_2: D58.2 SW58.2
NetD59_2: D59.2 SW59.2
NetD60_2: D60.2 SW60.2
NetD61_2: D61.2 SW61.2
NetD62_2: D62.2 SW62.2
NetD63_2: D63.2 SW63.2
NetD64_2: D64.2 SW64.2
NetD65_2: D65.2 SW65.2
NetD66_2: D66.2 SW66.2
NetD67_2: D67.2 SW67.2
NetD68_2: D68.2 SW68.2
NetD69_2: D69.2 SW69.2
NetD70_1: D70.1 D71.1 D72.1 D73.1 D74.1 D75.1 D76.1 D77.1 D78.1 D79.1 D80.1 D101.1 R167.2
NetD70_2: D70.2 SW70.2
NetD71_2: D71.2 SW71.2
NetD72_2: D72.2 SW72.2
NetD73_2: D73.2 SW73.2
NetD74_2: D74.2 SW74.2 SW75.2
NetD75_2: D75.2 SW76.2
NetD76_2: D76.2 SW77.2
NetD77_2: D77.2 SW78.2
NetD78_2: D78.2 SW79.2
NetD79_2: D79.2 SW80.2
NetD80_2: D80.2 SW81.2
NetD81_1: D81.1 R147.1 SW1.1 SW16.1 SW30.1 SW44.1 SW57.1 SW70.1
NetD82_1: D82.1 R148.1 SW2.1 SW17.1 SW31.1 SW45.1 SW58.1 SW71.1
NetD83_1: D83.1 R149.1 SW3.1 SW18.1 SW32.1 SW46.1 SW59.1 SW72.1
NetD84_1: D84.1 R150.1 SW4.1 SW19.1 SW33.1 SW47.1 SW60.1 SW73.1
NetD85_1: D85.1 R151.1 SW5.1 SW20.1 SW34.1 SW48.1 SW61.1
NetD86_1: D86.1 R152.1 SW6.1 SW21.1 SW35.1 SW49.1 SW62.1 SW74.1 SW75.1
NetD87_1: D87.1 R153.1 SW7.1 SW22.1 SW36.1 SW50.1 SW63.1
NetD88_1: D88.1 R154.1 SW8.1 SW23.1 SW37.1 SW51.1 SW64.1
NetD89_1: D89.1 R155.1 SW9.1 SW24.1 SW38.1 SW52.1 SW65.1 SW76.1
NetD90_1: D90.1 R156.1 SW10.1 SW25.1 SW39.1 SW53.1 SW66.1 SW77.1
NetD91_1: D91.1 R157.1 SW11.1 SW26.1 SW40.1 SW54.1 SW67.1 SW78.1
NetD92_1: D92.1 R158.1 SW12.1 SW27.1 SW41.1 SW55.1 SW68.1 SW79.1
NetD93_1: D93.1 R159.1 SW13.1 SW28.1 SW42.1 SW56.1 SW69.1 SW80.1
NetD94_1: D94.1 R160.1 SW14.1 SW29.1 SW81.1
NetD95_1: D95.1 R161.1 SW15.1 SW43.1
NetR147_2: R147.2 ; port KB_SCANMATRIX_CLMN_0
NetR148_2: R148.2 ; port KB_SCANMATRIX_CLMN_1
NetR149_2: R149.2 ; port KB_SCANMATRIX_CLMN_2
NetR150_2: R150.2 ; port KB_SCANMATRIX_CLMN_3
NetR151_2: R151.2 ; port KB_SCANMATRIX_CLMN_4
NetR152_2: R152.2 ; port KB_SCANMATRIX_CLMN_5
NetR153_2: R153.2 ; port KB_SCANMATRIX_CLMN_6
NetR154_2: R154.2 ; port KB_SCANMATRIX_CLMN_7
NetR155_2: R155.2 ; port KB_SCANMATRIX_CLMN_8
NetR156_2: R156.2 ; port KB_SCANMATRIX_CLMN_9
NetR157_2: R157.2 ; port KB_SCANMATRIX_CLMN_10
NetR158_2: R158.2 ; port KB_SCANMATRIX_CLMN_11
NetR159_2: R159.2 ; port KB_SCANMATRIX_CLMN_12
NetR160_2: R160.2 ; port KB_SCANMATRIX_CLMN_13
NetR161_2: R161.2 ; port KB_SCANMATRIX_CLMN_14

### Layout directives
net class column: NetD81_1, NetD82_1, NetD83_1, NetD84_1, NetD85_1, NetD86_1, NetD87_1, NetD88_1, NetD89_1, NetD90_1, NetD91_1, NetD92_1, NetD93_1, NetD94_1, NetD95_1
net class row: NetD1_1, NetD16_1, NetD30_1, NetD44_1, NetD57_1, NetD70_1

### Notes on the sheet
- KC_ESCAPE
- KC_F1
- KC_F2
- KC_F3
- KC_F4
- KC_F5
- KC_F6
- KC_F7
- KC_F8
- KC_F9
- KC_F10
- KC_F11
- KC_F12
- KC_INSERT
- KC_DELETE
- 15
- (near SW16) KC_GRAVE
- (near SW17) KC_1
- (near SW18) KC_2
- (near SW19) KC_3
- (near SW20) KC_4
- (near SW21) KC_5
- (near SW22) KC_6
- (near SW23) KC_7
- (near SW24) KC_8
- (near SW25) KC_9
- (near SW26) KC_0
- (near SW27) KC_EQUAL
- (near SW28) KC_GRAVE
- (near SW29) KC_BACKSLASH
- 14
- (near SW30) KC_TAB
- (near SW31) KC_Q
- (near SW32) KC_W
- (near SW33) KC_E
- (near SW34) KC_R
- (near SW35) KC_T
- (near SW36) KC_Z
- (near SW37) KC_U
- (near SW38) KC_I
- (near SW39) KC_O
- (near SW40) KC_P
- (near SW41) KC_LEFT_BRACKET
- (near SW42) KC_RIGHT_BRACKET
- (near SW43) KC_ENTER
- (near SW44) KC_CAPS_LOCK
- (near SW45) KC_A
- (near SW46) KC_S
- (near SW47) KC_D
- (near SW48) KC_F
- (near SW49) KC_G
- (near SW50) KC_H
- (near SW51) KC_J
- (near SW52) KC_K
- (near SW53) KC_L
- (near SW54) KC_SEMICOLON
- (near SW55) KC_QUOTE
- (near SW56) KC_NONUS_HASH
- 13
- (near SW57) KC_LEFT_SHIFT
- (near SW58) KC_BACKSLASH
- (near SW59) KC_Y
- (near SW60) KC_X
- (near SW61) KC_C
- (near SW62) KC_V
- (near SW63) KC_B
- (near SW64) KC_N
- (near SW65) KC_M
- (near SW66) KC_COMMA
- (near SW67) KC_DOT
- (near SW68) KC_SLASH
- (near SW69) KC_RIGHT_SHIFT
- (near SW70) KC_LEFT_CTRL
- (near SW71) MO(layer)
- (near SW72) KC_NO
- (near SW73) KC_LEFT_ALT
- (near SW74) KC_SPACE
- (near SW76) KC_RIGHT_CTRL
- (near SW77) KC_RIGHT_ALT
- (near SW78) KC_LEFT
- (near SW79) KC_UP
- (near SW80) KC_DOWN
- (near SW81) KC_RIGHT
- 12
- Keycode alignment based on QWERTY layout (eng)
- Specific keyfunctions being implemented in the firmware
- © OV Tech GmbH - Open Visions Technology
- (in symbol RES_0402_300R_1%) 0402

### Library data of the parts
?#2 = Titleblock_01
D1-D80 = Schottky 30V_BAT54LS-QYL: Schottky Diodes & Rectifiers; Manufacturer 1: Nexperia; Manufacturer 1 Prt. Nr.: BAT54LS-QYL
D81-D101 = ESD 5.5V_PESD5V5C1UL: ESD Diode 5.5V working voltage DFN1006-2; Manufacturer 1: Nexperia; Manufacturer 1 Prt. Nr.: PESD5V5C1UL
R147-R167 = RES_0402_300R_1%: Thick Film Resistors - SMD 300Ω 1%; Manufacturer 1: Panasonic; Manufacturer 1 Prt. Nr.: ERJ-2RKF3000X; Manufacturer 2 Prt. Nr.: SFR01MZPJ301; Manufacturer 2: ROHM Semiconductor
SW1-SW81 = SW_KEYBOARD_CPG1316S01D02: Switch for keyboard, PG1316S series, Push-on type S. P. S. T; Manufacturer 1: Kaihua Electronics; Manufacturer 1 Prt. Nr.: CPG1316S01D02